# EAGLE design Gamecube (EAGLE 9.6.2)
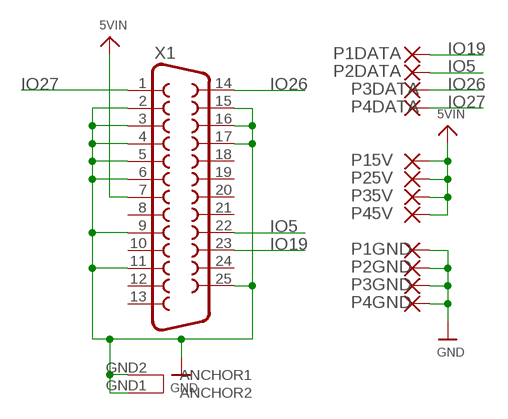
[diagram p0: schematic, sheet 1]

## Parts
P1DATA  SMD5  [SMD2,54-5,08]
P1GND  SMD5  [SMD2,54-5,08]
P2DATA  SMD5  [SMD2,54-5,08]
P2GND  SMD5  [SMD2,54-5,08]
P3DATA  SMD5  [SMD2,54-5,08]
P3GND  SMD5  [SMD2,54-5,08]
P4DATA  SMD5  [SMD2,54-5,08]
P4GND  SMD5  [SMD2,54-5,08]
P15V  SMD5  [SMD2,54-5,08]
P25V  SMD5  [SMD2,54-5,08]
P35V  SMD5  [SMD2,54-5,08]
P45V  SMD5  [SMD2,54-5,08]
X1  DB25_FEMALEHP  [F25HP]

## Nets
5VIN: P15V.1(P) P25V.1(P) P35V.1(P) P45V.1(P) X1.7
GND: P1GND.1(P) P2GND.1(P) P3GND.1(P) P4GND.1(P) X1.2 X1.3 X1.4 X1.5 X1.6 X1.9 X1.11 X1.15 X1.16 X1.17 X1.25 X1.GND1(ANCHOR2) X1.GND2(ANCHOR1)
IO5: P2DATA.1(P) X1.22
IO19: P1DATA.1(P) X1.23
IO26: P3DATA.1(P) X1.14
IO27: P4DATA.1(P) X1.1
Unconnected: X1.8 X1.10 X1.12 X1.13 X1.18 X1.19 X1.20 X1.21 X1.24

## Library data of the parts
P1DATA P1GND P2DATA P2GND P3DATA P3GND P4DATA P4GND P15V P25V P35V P45V = wirepad:SMD5: SMD PAD
X1 = SparkFun-Retired:DB25_FEMALE: 25 Pin male connector. PCB edge mount for regular PCB thicknesses. This connector will connect directly to the back of a PC parallel port or through a normal DB25 extension cable (M/F). SKU: PRT-08287

## Board
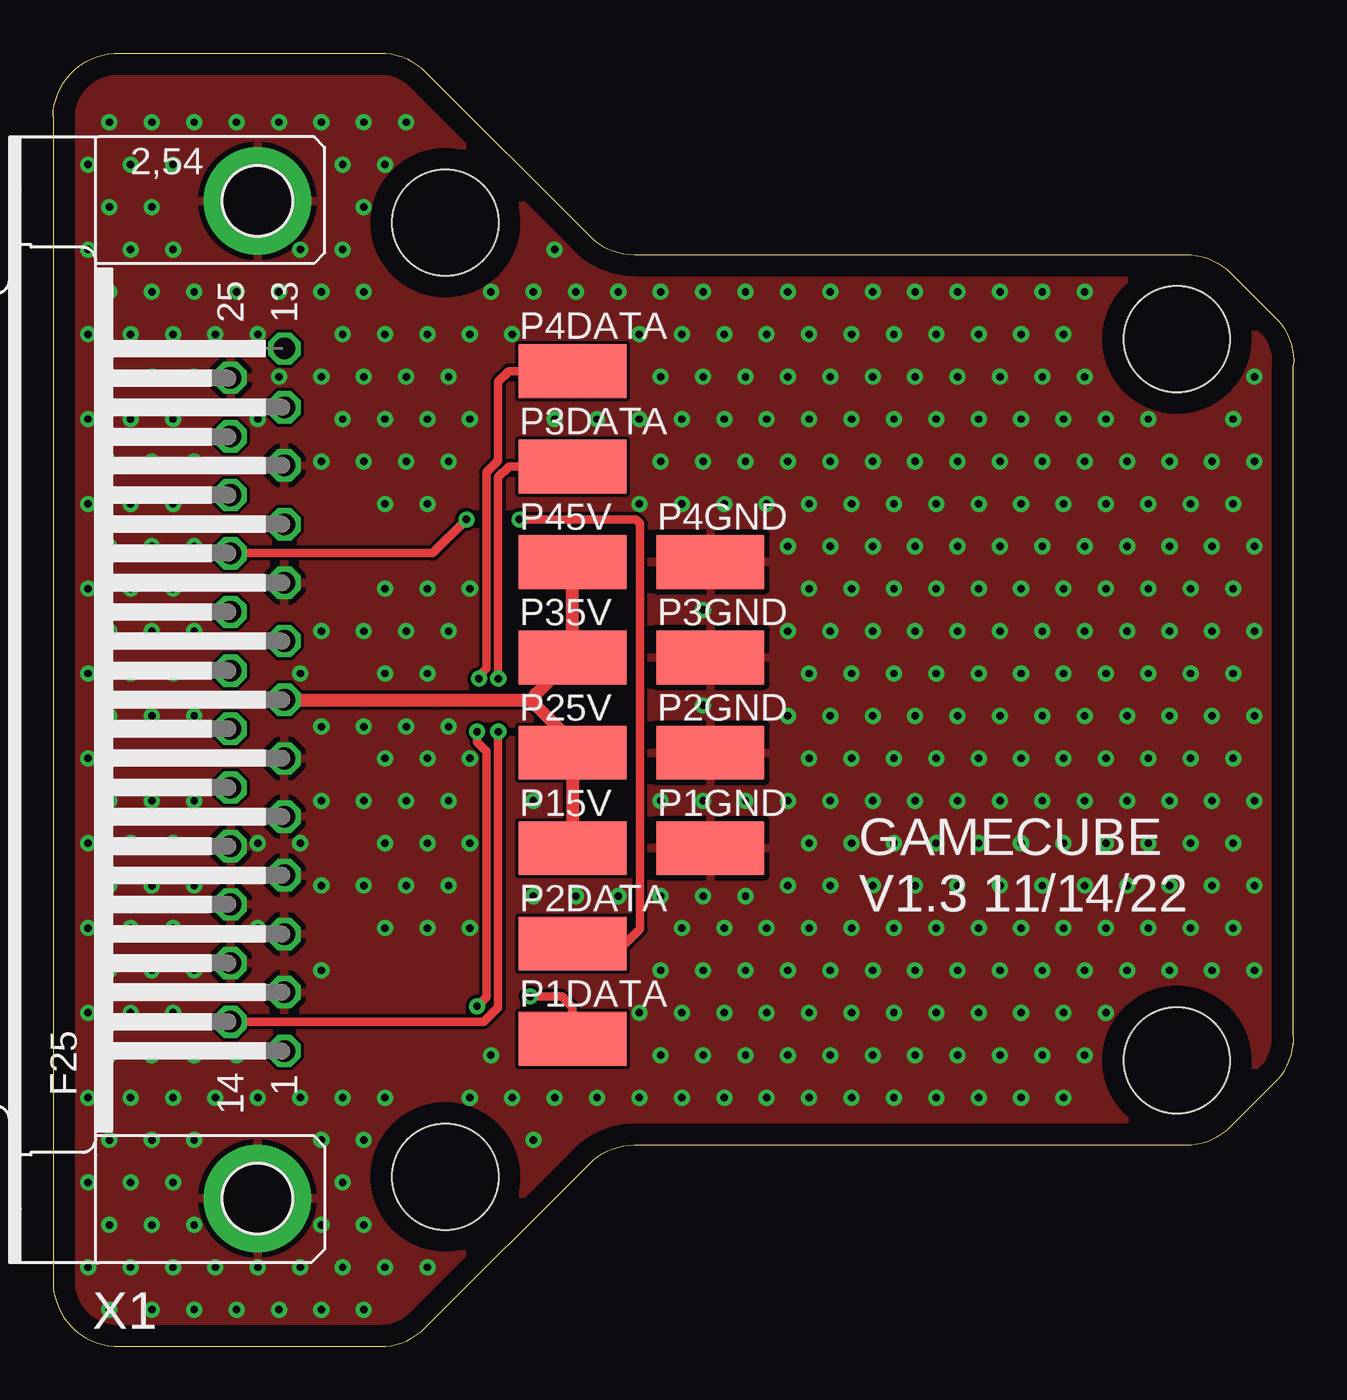
[diagram p1: board, top side]
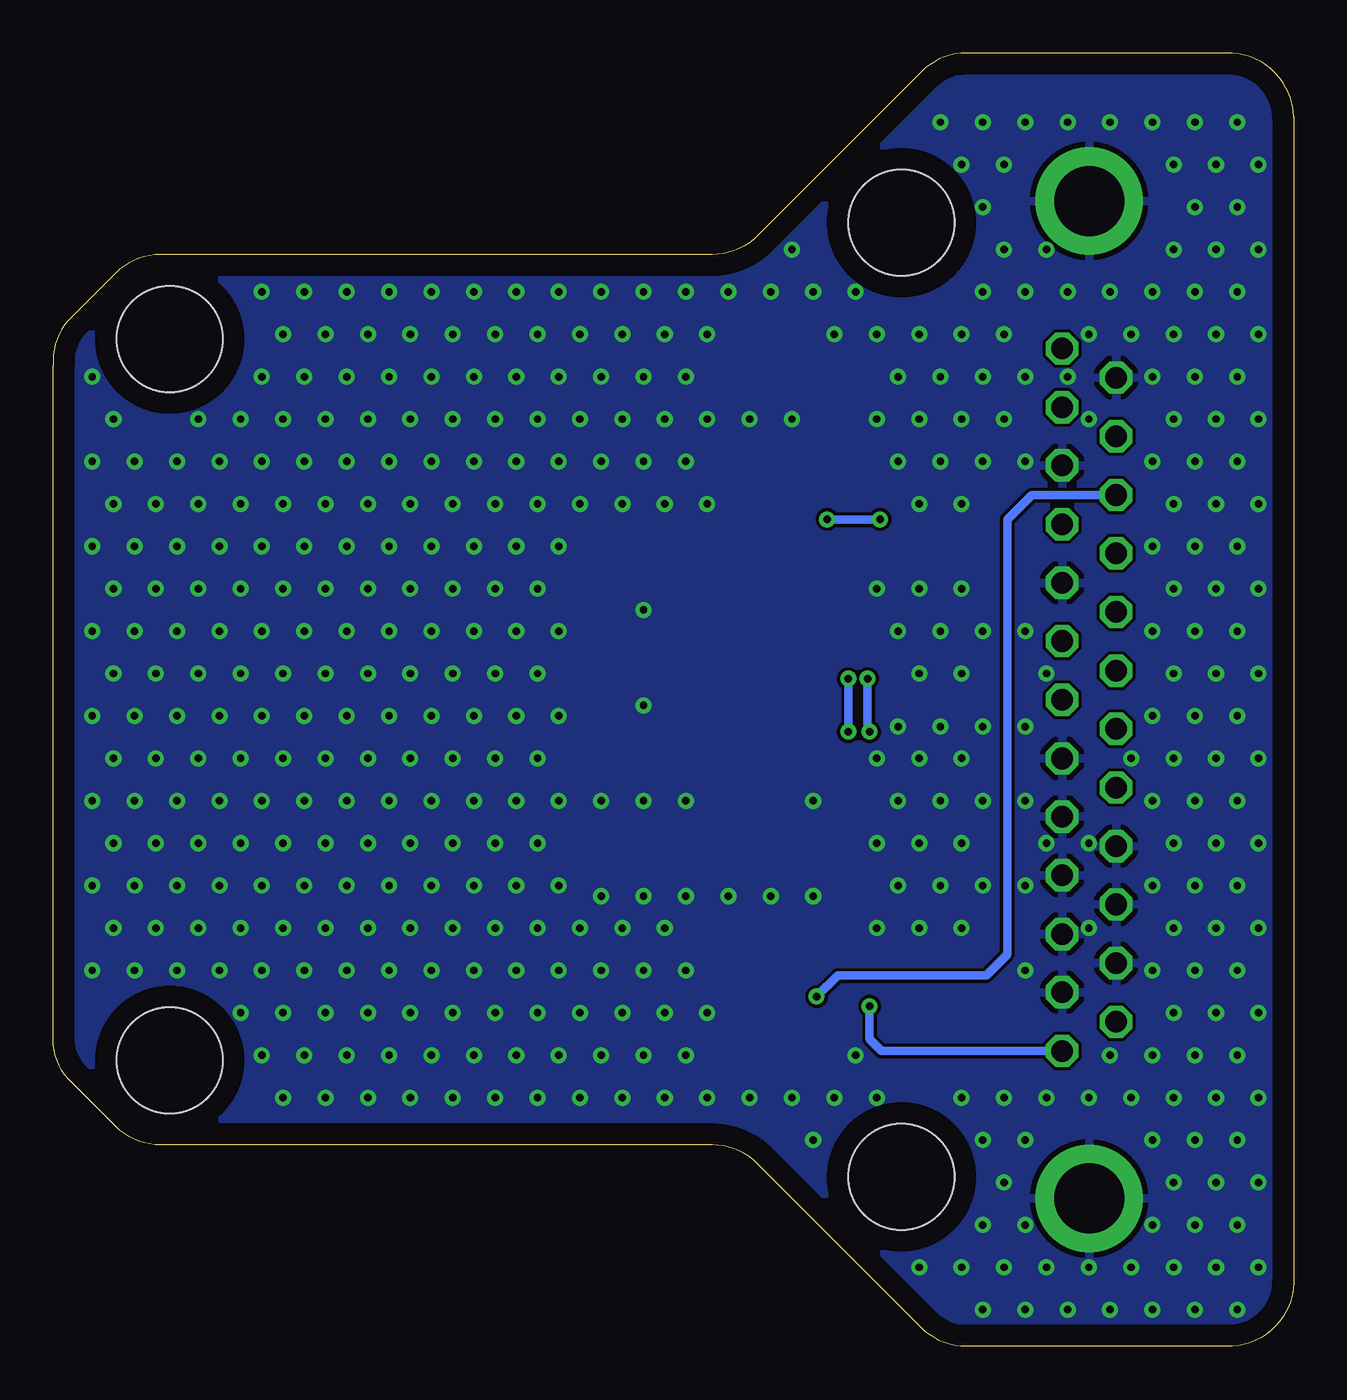
[diagram p2: board, bottom side, seen from below]

Size 58.51 x 61 mm. Coordinates in mm from the lower left corner, seen from the top.
Outline: 0,58 0,3 arc90 3.17,0 15.43,0 arc45 17.55,0.88 25.29,8.62 arc-45 27.41,9.5 53.43,9.5 arc45 55.55,10.38 57.79,12.62 arc45 58.5,14.74 58.5,46.26 arc45 57.79,48.38 55.55,50.62 arc45 53.43,51.5 27.41,51.5 arc-45 25.29,52.38 17.55,60.12 arc45 15.43,61 3.17,61 arc90 0,58
Copper layers (1*16): Top 0.035mm / dielectric 1.5mm / Bottom 0.035mm
Design rules "default": minimum track width 6mil, minimum drill 0.35mm, track to track 6mil, track to pad 6mil, pad to pad 6mil, via to via 6mil, smd to smd 6mil, copper to edge 40mil, drill to drill 6mil, minimum pad ring 10mil, minimum via ring 8mil, stop-mask expansion 4mil, vias tented up to drill 0.5mm, thermal gap 10mil
Holes 5 mm at 53,13.5 53,47.5 18.5,53 18.5,8

### Footprints (pad centres in the part's own frame; a part is rotated, then mirrored left to right if it is on the bottom)
SMD2,54-5,08 = smd 2.54 x 5.08: 1 0,0
F25HP = drill 1.016 octagon: 1 -16.561,-1.27; 2 -13.792,-1.27; 3 -11.049,-1.27; 4 -8.28,-1.27; 5 -5.512,-1.27; 6 -2.769,-1.27; 7 0,-1.27; 8 2.769,-1.27; 9 5.512,-1.27; 10 8.28,-1.27; 11 11.049,-1.27; 12 13.792,-1.27; 13 16.561,-1.27; 14 -15.189,1.27; 15 -12.421,1.27; 16 -9.652,1.27; 17 -6.909,1.27; 18 -4.14,1.27; 19 -1.372,1.27; 20 1.372,1.27; 21 4.14,1.27; 22 6.909,1.27; 23 9.652,1.27; 24 12.421,1.27; 25 15.189,1.27 | drill 3.302 pad 5.08: GND1 -23.52,0; GND2 23.52,0

### Placement (x,y rotation side)
P1DATA  24.5,14.5 270 top
P1GND  31,23.5 270 top
P2DATA  24.5,19 270 top
P2GND  31,28 270 top
P3DATA  24.5,41.5 270 top
P3GND  31,32.5 270 top
P4DATA  24.5,46 270 top
P4GND  31,37 270 top
P15V  24.5,23.5 270 top
P25V  24.5,28 270 top
P35V  24.5,32.5 270 top
P45V  24.5,37 270 top
X1  9.64,30.5 90 top

### Tracks (layer width: path | path; a pad name or v marks a point on that pad's centre or on a via)
5VIN
  Top 0.61: X1.7 22.5,30.5 22.75,30.25 | 22.75,30.25 24.5,28.5 P25V.1 P15V.1 | 22.75,30.25 22.75,30.75 P35V.1 P45V.1
GND  (via drill 0.35)
  other vias: 2.66,1.74 1.66,3.74 2.66,5.74 1.66,7.74 2.66,9.74 1.66,11.74 2.66,13.74 1.66,15.74 2.66,17.74 1.66,19.74 2.66,21.74 1.66,23.74 2.66,25.74 1.66,27.74 2.66,29.74 1.66,31.74 2.66,33.74 1.66,35.74 2.66,37.74 1.66,39.74 2.66,41.74 1.66,43.74 2.66,45.74 1.66,47.74 2.66,49.74 1.66,51.74 2.66,53.74 1.66,55.74 2.66,57.74 4.66,1.74 3.66,3.74 4.66,5.74 3.66,7.74 4.66,9.74 3.66,11.74 4.66,13.74 3.66,15.74 4.66,17.74 3.66,19.74 4.66,21.74 3.66,23.74 4.66,25.74 3.66,27.74 4.66,29.74 3.66,31.74 4.66,33.74 3.66,35.74 4.66,37.74 3.66,39.74 4.66,41.74 3.66,43.74 4.66,45.74 3.66,47.74 4.66,49.74 3.66,51.74 4.66,53.74 3.66,55.74 4.66,57.74 6.66,1.74 5.66,3.74 6.66,5.74 5.66,7.74 6.66,9.74 5.66,11.74 6.66,13.74 5.66,15.74 6.66,17.74 5.66,19.74 6.66,21.74 5.66,23.74 6.66,25.74 5.66,27.74 6.66,29.74 5.66,31.74 6.66,33.74 5.66,35.74 6.66,37.74 5.66,39.74 6.66,41.74 5.66,43.74 6.66,45.74 5.66,47.74 6.66,49.74 5.66,51.74 5.66,55.74 6.66,57.74 8.66,1.74 7.66,3.74 7.66,11.74 8.66,13.74 7.66,27.74 7.66,47.74 8.66,49.74 8.66,57.74 10.66,1.74 9.66,3.74 9.66,11.74 9.66,19.74 9.66,23.74 9.66,43.74 10.66,45.74 9.66,47.74 10.66,49.74 10.66,57.74 12.66,1.74 11.66,3.74 12.66,5.74 12.66,9.74 11.66,11.74 12.66,17.74 12.66,21.74 11.66,23.74 12.66,25.74 12.66,29.24 11.66,31.74 12.66,33.74 12.66,41.74 12.66,45.74 12.66,49.74 11.66,51.74 12.66,57.74 14.66,1.74 13.66,3.74 14.66,5.74 13.66,7.74 14.66,9.74 13.66,11.74 14.66,21.74 14.66,25.74 14.66,29.24 14.66,33.74 14.66,41.74 13.66,43.74 14.66,45.74 13.66,47.74 14.66,49.74 13.66,51.74 14.66,53.74 13.66,55.74 14.66,57.74 15.66,3.74 15.66,11.74 15.66,19.74 16.66,21.74 15.66,23.74 16.66,25.74 15.66,27.74 16.66,29.24 15.66,31.74 16.66,33.74 15.66,35.74 15.66,39.74 16.66,41.74 15.66,43.74 16.66,45.74 15.66,47.74 15.66,55.74 16.66,57.74 17.66,3.74 17.66,19.74 18.66,21.74 17.66,23.74 18.66,25.74 17.66,27.74 18.66,29.24 17.66,31.74 18.66,33.74 17.66,35.74 17.66,39.74 18.66,41.74 17.66,43.74 18.66,45.74 17.66,47.74 19.66,11.74 20.66,13.74 19.66,19.74 19.66,23.74 19.66,27.74 19.66,35.74 19.66,43.74 19.66,47.74 20.66,49.74 22.66,9.74 21.66,11.74 22.66,21.24 22.66,25.74 21.66,47.74 22.66,49.74 23.66,11.74 24.66,21.24 23.66,43.74 24.66,49.74 23.66,51.74 25.66,11.74 26.66,21.24 25.66,43.74 26.66,49.74 27.66,11.74 28.66,13.74 27.66,15.74 28.66,17.74 28.66,21.24 28.66,25.74 27.66,39.74 28.66,41.74 27.66,43.74 28.66,45.74 27.66,47.74 28.66,49.74 29.66,11.74 30.66,13.74 29.66,15.74 30.66,17.74 29.66,19.74 30.66,21.24 30.66,25.74 30.66,30.24 30.66,34.74 29.66,39.74 30.66,41.74 29.66,43.74 30.66,45.74 29.66,47.74 30.66,49.74 31.66,11.74 32.66,13.74 31.66,15.74 32.66,17.74 31.66,19.74 32.66,21.24 32.66,25.74 31.66,39.74 32.66,41.74 31.66,43.74 32.66,45.74 31.66,47.74 32.66,49.74 33.66,11.74 34.66,13.74 33.66,15.74 34.66,17.74 33.66,19.74 34.66,21.74 34.66,25.74 34.66,29.74 34.66,33.74 34.66,37.74 33.66,39.74 34.66,41.74 33.66,43.74 34.66,45.74 33.66,47.74 34.66,49.74 35.66,11.74 36.66,13.74 35.66,15.74 36.66,17.74 35.66,19.74 36.66,21.74 35.66,23.74 36.66,25.74 35.66,27.74 36.66,29.74 35.66,31.74 36.66,33.74 35.66,35.74 36.66,37.74 35.66,39.74 36.66,41.74 35.66,43.74 36.66,45.74 35.66,47.74 36.66,49.74 37.66,11.74 38.66,13.74 37.66,15.74 38.66,17.74 37.66,19.74 38.66,21.74 37.66,23.74 38.66,25.74 37.66,27.74 38.66,29.74 37.66,31.74 38.66,33.74 37.66,35.74 38.66,37.74 37.66,39.74 38.66,41.74 37.66,43.74 38.66,45.74 37.66,47.74 38.66,49.74 39.66,11.74 40.66,13.74 39.66,15.74 40.66,17.74 39.66,19.74 40.66,21.74 39.66,23.74 40.66,25.74 39.66,27.74 40.66,29.74 39.66,31.74 40.66,33.74 39.66,35.74 40.66,37.74 39.66,39.74 40.66,41.74 39.66,43.74 40.66,45.74 39.66,47.74 40.66,49.74 41.66,11.74 42.66,13.74 41.66,15.74 42.66,17.74 41.66,19.74 42.66,21.74 41.66,23.74 42.66,25.74 41.66,27.74 42.66,29.74 41.66,31.74 42.66,33.74 41.66,35.74 42.66,37.74 41.66,39.74 42.66,41.74 41.66,43.74 42.66,45.74 41.66,47.74 42.66,49.74 43.66,11.74 44.66,13.74 43.66,15.74 44.66,17.74 43.66,19.74 44.66,21.74 43.66,23.74 44.66,25.74 43.66,27.74 44.66,29.74 43.66,31.74 44.66,33.74 43.66,35.74 44.66,37.74 43.66,39.74 44.66,41.74 43.66,43.74 44.66,45.74 43.66,47.74 44.66,49.74 45.66,11.74 46.66,13.74 45.66,15.74 46.66,17.74 45.66,19.74 46.66,21.74 45.66,23.74 46.66,25.74 45.66,27.74 46.66,29.74 45.66,31.74 46.66,33.74 45.66,35.74 46.66,37.74 45.66,39.74 46.66,41.74 45.66,43.74 46.66,45.74 45.66,47.74 46.66,49.74 47.66,11.74 48.66,13.74 47.66,15.74 48.66,17.74 47.66,19.74 48.66,21.74 47.66,23.74 48.66,25.74 47.66,27.74 48.66,29.74 47.66,31.74 48.66,33.74 47.66,35.74 48.66,37.74 47.66,39.74 48.66,41.74 47.66,43.74 48.66,45.74 47.66,47.74 48.66,49.74 49.66,15.74 50.66,17.74 49.66,19.74 50.66,21.74 49.66,23.74 50.66,25.74 49.66,27.74 50.66,29.74 49.66,31.74 50.66,33.74 49.66,35.74 50.66,37.74 49.66,39.74 50.66,41.74 49.66,43.74 52.66,17.74 51.66,19.74 52.66,21.74 51.66,23.74 52.66,25.74 51.66,27.74 52.66,29.74 51.66,31.74 52.66,33.74 51.66,35.74 52.66,37.74 51.66,39.74 52.66,41.74 51.66,43.74 54.66,17.74 53.66,19.74 54.66,21.74 53.66,23.74 54.66,25.74 53.66,27.74 54.66,29.74 53.66,31.74 54.66,33.74 53.66,35.74 54.66,37.74 53.66,39.74 54.66,41.74 56.66,17.74 55.66,19.74 56.66,21.74 55.66,23.74 56.66,25.74 55.66,27.74 56.66,29.74 55.66,31.74 56.66,33.74 55.66,35.74 56.66,37.74 55.66,39.74 56.66,41.74 55.66,43.74 56.66,45.74
  pour Top: 0,0 0,61 28.67,61 28.67,51.5 59.17,51.5 59.17,9.5 28.17,9.5 28.17,0
  pour Bottom: 0,0 0,61 28.67,61 28.67,51.5 59.17,51.5 59.17,9.5 28.17,9.5 28.17,0
IO5  (via drill 0.35)
  Top 0.406: P2DATA.1 27,19 27.69,19.69 27.69,38.81 27.5,39 v22,39 | X1.22 17.91,37.41 v19.5,39
  Bottom 0.406: v22,39 v19.5,39
IO19  (via drill 0.35)
  Top 0.406: P1DATA.1 24.5,16 24,16.5 v22.5,16.5
  Bottom 0.406: X1.23 12.35,40.15 13.5,39 13.5,18.5 14.5,17.5 21.5,17.5 v22.5,16.5
IO26  (via drill 0.35)
  Top 0.406: P3DATA.1 21.5,41.5 21,41 v21,31.5 | v21,29 21,16 20.31,15.31 X1.14
  Bottom 0.406: v21,31.5 v21,29
IO27  (via drill 0.35)
  Top 0.406: P4DATA.1 21.5,46 21,45.5 21,41.79 20.44,41.23 20.44,31.98 20.27,31.8 20.27,31.68 v20.09,31.5 | v20,29 20,28.5 20.44,28.06 20.44,16.49 v20,16.05
  Bottom 0.406: v20.09,31.5 20.09,29.09 v20,29 | v20,16.05 20,14.5 19.44,13.94 X1.1

### Text on the board
tPlace: GAMECUBE / V1.3 11/14/22